# Altium schematic sheet 1_CC1310RF.SchDoc
size 297 x 209 mm
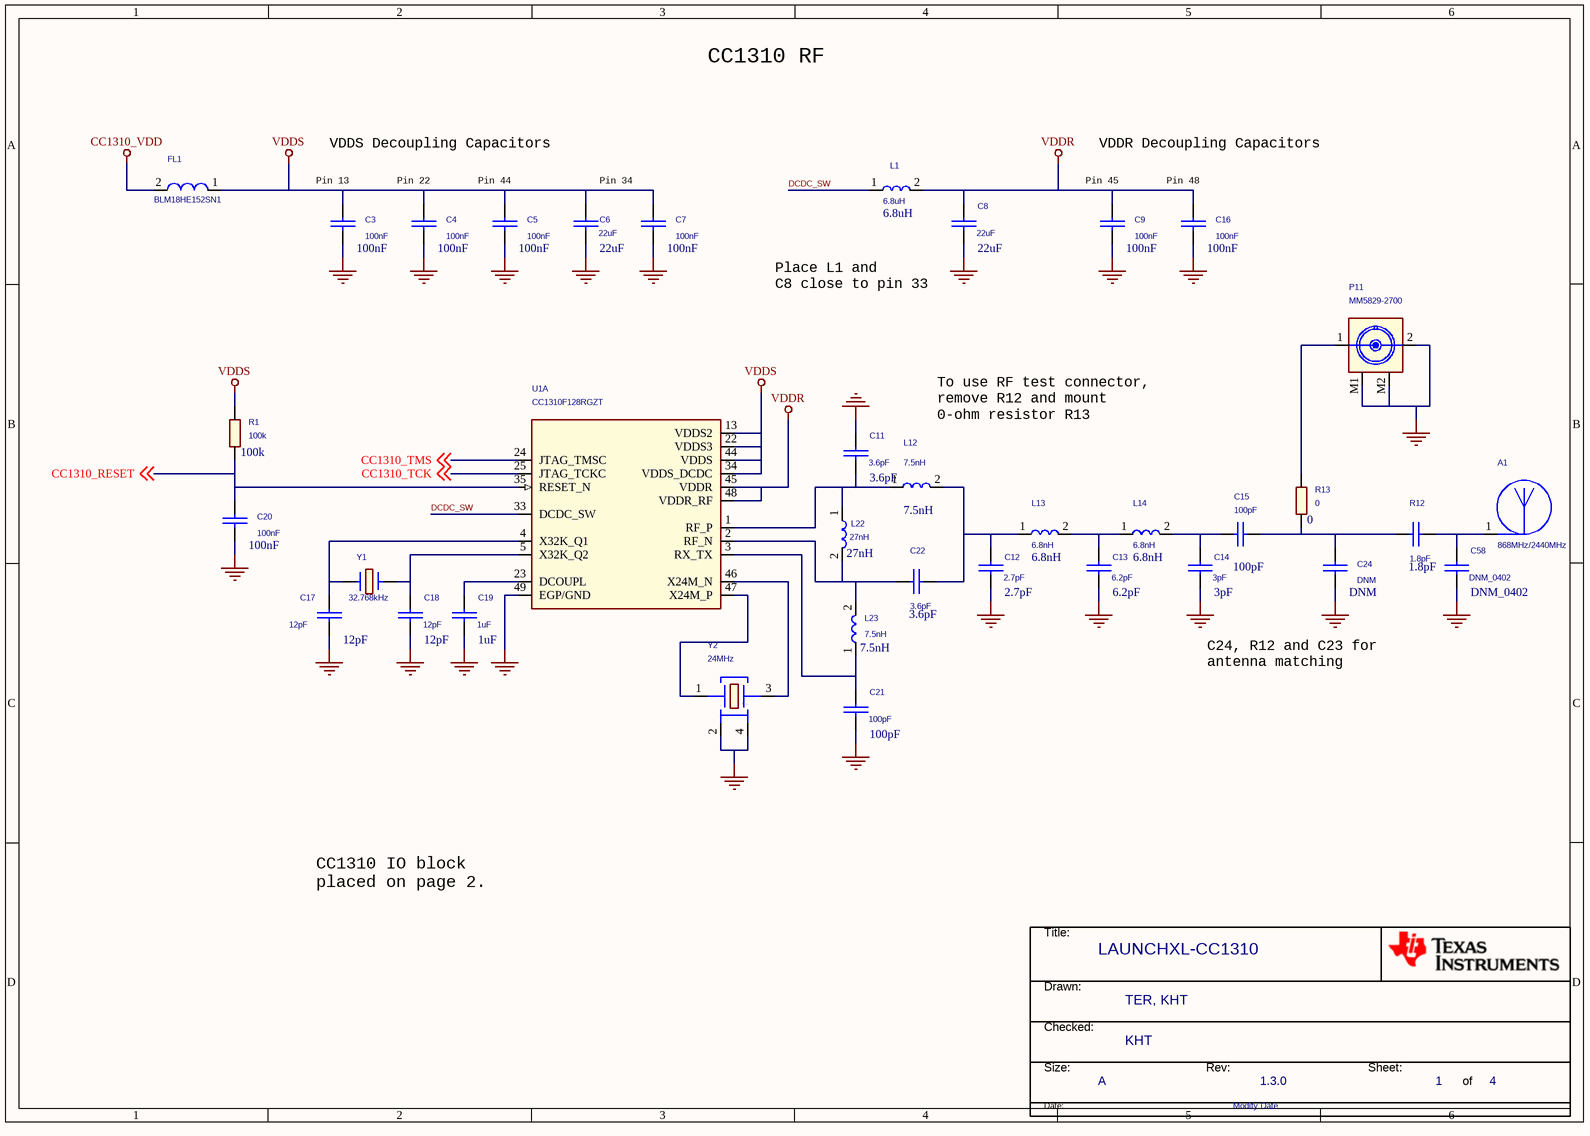
[diagram p0: 1_CC1310RF.SchDoc]

## Parts
*  Designer name: KHT  Check name: TER, KHT  Design Modify Date: Modify Date  Page Size: A  RevCode: 1.3.0  Page Count: 4  Page Number: 1  Title: LAUNCHXL-CC1310  (hidden comment: TI_Norway_Title_Block_BMP)  (graphical)
A1  868MHz/2440MHz  [ANTENNA_DN024N]
C3  100nF  [CAPC1005X60B2N]
C4  100nF  [CAPC1005X60B2N]
C5  100nF  [CAPC1005X60B2N]
C6  22uF  [CAPC1608X100A2N]
C7  100nF  [CAPC1005X60B2N]
C8  22uF  [CAPC1608X100A2L]
C9  100nF  [CAPC1005X60B2N]
C11  3.6pF  [CAPC1005X60B2N]
C12  2.7pF  [CAPC1005X60B2N]
C13  6.2pF  [CAPC1005X60B2N]
C14  3pF  [CAPC1005X60B2N]
C15  100pF  [CAPC1005X60B2N]
C16  100nF  [CAPC1005X60B2N]
C17  12pF  [CAPC1005X60B2N]
C18  12pF  [CAPC1005X60B2N]
C19  1uF  [CAPC1005X60B2N]
C20  100nF  [CAPC1005X60B2N]
C21  100pF  [CAPC1005X60B2N]
C22  3.6pF  [CAPC1005X60B2N]
C24  DNM  [CAPC1005X60B2N]
C58  DNM_0402  [CAPC1005X60B2N]
FL1  BLM18HE152SN1  [FIL_BLM18HE152SN1DL]
L1  6.8uH  [INDC2012X150L]
L12  7.5nH  [INDC1005X60B2N]
L13  6.8nH  [INDC1005X60B2N]
L14  6.8nH  [INDC1005X60B2N]
L22  27nH  [INDC1005X60B2N]
L23  7.5nH  [INDC1005X60B2N]
P11  MM5829-2700  [MURATA_MM58292700RJ4_A2N]
R1  100k  [RESC1005X40B2N]
R12  1.8pF  [CAPC1005X60B2N]
R13  0  [RESC1005X40B2N]
U1  CC1310F128RGZT  [QFNFC50P700X700X100-49A2N]  (part A of 2)
Y1  32.768kHz  [XTAL_FC-135N]
Y2  24MHz  [OSCCC250X320X60-4L]

## Nets
CC1310_VDD: FL1.2
GND: C3.2 C4.2 C5.2 C6.2 C7.2 C8.2 C9.2 C11.1 C12.2 C13.2 C14.2 C16.2 C17.2 C18.2 C19.2 C20.2 C21.2 C24.2 C58.2 P11.2 P11.M1 P11.M2 U1.49(EGP/GND) Y2.2 Y2.4
VDDR: C8.1 C9.1 C16.1 L1.2 U1.45(VDDR) U1.48(VDDR_RF)
VDDS: C3.1 C4.1 C5.1 C6.1 C7.1 FL1.1 R1.2 U1.13(VDDS2) U1.22(VDDS3) U1.34(VDDS_DCDC) U1.44(VDDS)
CC1310_RESET: C20.1 R1.1 U1.35(RESET_N) ; off-sheet CC1310_RESET
CC1310_TCK: U1.25(JTAG_TCKC) ; off-sheet CC1310_TCK
CC1310_TMS: U1.24(JTAG_TMSC) ; off-sheet CC1310_TMS
DCDC_SW: L1.1 U1.33(DCDC_SW)
NetA1_1: A1.1 C58.1 R12.2
NetC11_2: C11.2 L12.1 L22.1 U1.1(RF_P)
NetC12_1: C12.1 C22.2 L12.2 L13.1
NetC13_1: C13.1 L13.2 L14.1
NetC14_1: C14.1 C15.1 L14.2
NetC15_2: C15.2 C24.1 R12.1 R13.1
NetC17_1: C17.1 U1.4(X32K_Q1) Y1.1
NetC18_1: C18.1 U1.5(X32K_Q2) Y1.2
NetC19_1: C19.1 U1.23(DCOUPL)
NetC21_1: C21.1 L23.1 U1.3(RX_TX)
NetC22_1: C22.1 L22.2 L23.2 U1.2(RF_N)
NetP11_1: P11.1 R13.2
NetU1_46: U1.46(X24M_N) Y2.3
NetU1_47: U1.47(X24M_P) Y2.1

## Notes on the sheet
- CC1310 RF
- (near C3) Pin 13
- VDDS Decoupling Capacitors
- (near C4) Pin 22
- (near C5) Pin 44
- Pin 34
- (near C9) Pin 45
- VDDR Decoupling Capacitors
- (near C16) Pin 48
- (near C8) Place L1 and
  C8 close to pin 33
- To use RF test connector,
  remove R12 and mount
  0-ohm resistor R13
- C24, R12 and C23 for
  antenna matching
- CC1310 IO block
  placed on page 2.
- (in symbol TI_Norway_Title_Block_BMP) Title:; Drawn:; Checked:; Size:; Rev:; Sheet:; of; Date:

## Library data of the parts
* = TI_Norway_Title_Block_BMP: OrgName: Texas Instruments
A1 = ANTENNA_PCB: ANTENNA, NON COMPONENT, DUAL BAND OPTION - 868MHz/2440MHz, NOT APPLY; Vendor Part Status: ACTIVE; Vendor Part Number: DN024; Part Number: 13-01029; Designed by: Artur Bielinski; CLASS: DISCRETE; Client Status: UNDER_REVIEW; Vendor: TEXAS INSTRUMENTS; Mounting Type: NOT APPLY; BU Name: DYNAMIC PRECISION GDANSK; Design date: 2014-08-21; AutoDoc File: https://notefied-dynamic-precision.com/DB/Apps/Desktop/Item/Object.aspx?id=96668; Datasheet URL 2: N/A; Datasheet URL 1: http://www.ti.com/lit/swra227; Country of Origin: MISSING INFO; Weight: N/A; Packing Type: N/A; Packing Size: N/A; Last Time Buy: N/A; Budget Currency: N/A; Budget Price: N/A; Lead Time: N/A; RoHS Status: MISSING_INFO; Frequency: 868MHz/2440MHz; Min Oper Temp: N/A; Max Oper Temp: N/A; Part Type: MECHANIC\ANTENNA\NON_COMPONENT; Revision: R001
C3 C4 C7 C20 = CAPACITOR: CAPACITOR, CERAMIC X7R, 100nF, 6.3V, -10%/+10%, -55DEGC/+125DEGC, 0402, SMD; Vendor Part Status: NRND; Vendor Part Number: GRM155R70J104KA01D; MPN Status: ACTIVE; Part Number: 02-07610; VOLTAGE: CMAX; CURRENT: CIMAX; KNEE: CBMAX; PSpiceTemplate: C^@REFDES %1 %2 ?TOLERANCE|C^@REFDES| @VALUE ?IC/IC=@IC/ TC=@TC1,@TC2 ?TOLERANCE|\n.model C^@REFDES CAP C=1 DEV=@TOLERANCE%|; DIST: FLAT; SLOPE: CSMAX; MAX_TEMP: CTMAX; TC1: 0; Vendor: MURATA; BU Name: TEXAS INSTRUMENTS NORWAY; Packing Type: TAPE_&_REEL; Packing Size: 10000; Budget Currency: EUR; Budget Price: 0.007; Lead Time: 14; NOTE Status: PREFERRED; Min Tol: -10%; Max Tol: +10%; PCB Package: 0402; Old Footprint: CAPC1005X60N,0402; TC2: 0; Value: 100nF; Country of Origin: PHILIPPINES; Last Time Buy: N/A; AutoDoc File: https://notefied-dynamic-precision.com/DB/Apps/Desktop/Item/Object.aspx?id=113338; Datasheet URL 2: http://search.murata.co.jp/Ceramy/image/img/w_hinm/L0005E.pdf; Datasheet URL 1: http://psearch.murata.com/capacitor/product/GRM155R70J104KA01%23.pdf; WEIGHT: 0.0016g; LifeCycle Status: ACTIVE; RoHS Status: ROHS_COMPLIANT; MPN: GRM155R70J104KA01D; Manufacturer: MURATA; Dielectric Type: X7R; Capacitance: 100nF; Rtd Voltage: 6.3V; Min Oper Temp: -55DEGC; Max Oper Temp: +125DEGC; Part Type: CAPACITOR\CERAMIC\0402\STANDARD; Mounting Type: SMD; Revision: R000
C5 C9 C16 = CAPACITOR: CAPACITOR, CERAMIC X7R, 100nF, 6.3V, -10%/+10%, -55DEGC/+125DEGC, 0402, SMD; Vendor Part Status: NRND; Vendor Part Number: GRM155R70J104KA01D; Part Number: 02-07610; MPN Status: ACTIVE; VOLTAGE: CMAX; CURRENT: CIMAX; KNEE: CBMAX; PSpiceTemplate: C^@REFDES %1 %2 ?TOLERANCE|C^@REFDES| @VALUE ?IC/IC=@IC/ TC=@TC1,@TC2 ?TOLERANCE|\n.model C^@REFDES CAP C=1 DEV=@TOLERANCE%|; DIST: FLAT; SLOPE: CSMAX; MAX_TEMP: CTMAX; TC1: 0; Vendor: MURATA; BU Name: TEXAS INSTRUMENTS NORWAY; Old Footprint: CAPC1005X60N,0402; PCB Package: 0402; Max Tol: +10%; Min Tol: -10%; NOTE Status: PREFERRED; Lead Time: 14; Budget Price: 0.007; Budget Currency: EUR; Packing Size: 10000; Packing Type: TAPE_&_REEL; TC2: 0; Value: 100nF; Country of Origin: PHILIPPINES; Last Time Buy: N/A; Revision: R000; Mounting Type: SMD; Part Type: CAPACITOR\CERAMIC\0402\STANDARD; Max Oper Temp: +125DEGC; Min Oper Temp: -55DEGC; Rtd Voltage: 6.3V; Capacitance: 100nF; Dielectric Type: X7R; Manufacturer: MURATA; MPN: GRM155R70J104KA01D; RoHS Status: ROHS_COMPLIANT; LifeCycle Status: ACTIVE; WEIGHT: 0.0016g; Datasheet URL 1: http://psearch.murata.com/capacitor/product/GRM155R70J104KA01%23.pdf; Datasheet URL 2: http://search.murata.co.jp/Ceramy/image/img/w_hinm/L0005E.pdf; AutoDoc File: https://notefied-dynamic-precision.com/DB/Apps/Desktop/Item/Object.aspx?id=113338
C6 = CAPACITOR: CAPACITOR, CERAMIC, X5R, 22uF, 6.3V, -20%/+20%, -55DEGC/+85DEGC, 0603, SMD; Vendor Part Status: ACTIVE; Vendor Part Number: GRM188R60J226MEA0D; Part Number: 02-07053; VOLTAGE: CMAX; CURRENT: CIMAX; KNEE: CBMAX; PSpiceTemplate: C^@REFDES %1 %2 ?TOLERANCE|C^@REFDES| @VALUE ?IC/IC=@IC/ TC=@TC1,@TC2 ?TOLERANCE|\n.model C^@REFDES CAP C=1 DEV=@TOLERANCE%|; DIST: FLAT; SLOPE: CSMAX; MAX_TEMP: CTMAX; TC1: 0; Client Status: UNDER_REVIEW; ALT_SYMBOLS: CAPC1608X100A2L,CAPC1608X100A2M; Vendor: MURATA; BU Name: DYNAMIC PRECISION GDANSK; PCB Package: 0603; Max Tol: +20%; Min Tol: -20%; NOTE Status: PREFERRED; Lead Time: 26; Budget Price: 0.062; Budget Currency: EUR; Definied Quality: INDUSTRIAL; Packing Size: 4000; Packing Type: TAPE_&_REEL; TC2: 0; Value: 22uF; Country of Origin: JAPAN; Revision: R001; Old Footprint: CAPC1608X100A2N; Mounting Type: SMD; Part Type: CAPACITOR\CERAMIC\0603\STANDARD; Max Oper Temp: +85DEGC; Min Oper Temp: -55DEGC; Rtd Voltage: 6.3V; Capacitance: 22uF; Dielectric Type: X5R; Manufacturer: MURATA; MPN: GRM188R60J226MEA0D; MPN Status: ACTIVE; RoHS Status: ROHS_COMPLIANT; Last Time Buy: N/A; WEIGHT: 0.0091g; Esd Level: N/A; MTBF: N/A; MTBF Standard: N/A; MSL: N/A; Datasheet URL 1: http://psearch.murata.com/capacitor/product/GRM188R60J226MEA0%23.pdf; Datasheet URL 2: N/A; AutoDoc File: https://notefied-dynamic-precision.com/DB/Apps/Desktop/Item/Object.aspx?id=104385; LifeCycle Status: ACTIVE
C8 = CAPACITOR: CAPACITOR, CERAMIC, X5R, 22uF, 6.3V, -20%/+20%, -55DEGC/+85DEGC, 0603, SMD; Part Number: 02-07053; Manufacturer: MURATA; MPN: GRM188R60J226MEA0D; MPN Status: ACTIVE; VOLTAGE: CMAX; CURRENT: CIMAX; KNEE: CBMAX; PSpiceTemplate: C^@REFDES %1 %2 ?TOLERANCE|C^@REFDES| @VALUE ?IC/IC=@IC/ TC=@TC1,@TC2 ?TOLERANCE|\n.model C^@REFDES CAP C=1 DEV=@TOLERANCE%|; DIST: FLAT; SLOPE: CSMAX; MAX_TEMP: CTMAX; TC1: 0; FPLIST: CAPC1608X100A2N,CAPC1608X100A2L,CAPC1608X100A2M; ALT_SYMBOLS: CAPC1608X100A2L,CAPC1608X100A2M; Old Footprint: CAPC1608X100A2N; PCB Package: 0603; Max Tol: +20%; Min Tol: -20%; NOTE Status: PREFERRED; Lead Time: 26; Budget Price: 0.062; Budget Currency: EUR; Definied Quality: INDUSTRIAL; Packing Size: 4000; Packing Type: TAPE_&_REEL; TC2: 0; Value: 22uF; Revision: R001; Mounting Type: SMD; Part Type: CAPACITOR\CERAMIC\0603; Max Oper Temp: +85DEGC; Min Oper Temp: -55DEGC; Rtd Voltage: 6.3V; Capacitance: 22uF; Dielectric Type: X5R; RoHS Status: ROHS_COMPLIANT; LifeCycle Status: ACTIVE; Last Time Buy: N/A; WEIGHT: 0.0091g; Esd Level: N/A; MTBF: N/A; MTBF Standard: N/A; MSL: N/A; Datasheet URL 1: N/A; Datasheet URL 2: http://psearch.murata.com/capacitor/product/GRM188R60J226MEA0%23.pdf; AutoDoc File: http://notefied-dynamic-precision.com/DB/Apps/Desktop/Item/Object.aspx?id=104385
C11 = CAPACITOR: CAPACITOR, CERAMIC C0G/NP0, 3.6pF, 50V, -0.25pF/+0.25pF, -55DEGC/+125DEGC, 0402, SMD; Vendor Part Status: ACTIVE; Vendor Part Number: GRM1555C1H3R6CA01D; Part Number: 02-07631; VOLTAGE: CMAX; CURRENT: CIMAX; KNEE: CBMAX; PSpiceTemplate: C^@REFDES %1 %2 ?TOLERANCE|C^@REFDES| @VALUE ?IC/IC=@IC/ TC=@TC1,@TC2 ?TOLERANCE|\n.model C^@REFDES CAP C=1 DEV=@TOLERANCE%|; DIST: FLAT; SLOPE: CSMAX; MAX_TEMP: CTMAX; TC1: 0; Vendor: MURATA; BU Name: TEXAS INSTRUMENTS NORWAY; Packing Type: TAPE_&_REEL; Packing Size: 10000; Definied Quality: INDUSTRIAL; Budget Currency: EUR; Budget Price: 0.006; Lead Time: 12; NOTE Status: PREFERRED; PCB Package: 0402; Old Footprint: CAPC1005X60N; TC2: 0; Value: 3.6pF; Country of Origin: MISSING INFO; AutoDoc File: https://notefied-dynamic-precision.com/DB/Apps/Desktop/Item/Object.aspx?id=113359; Datasheet URL 2: N/A; Datasheet URL 1: http://psearch.murata.com/capacitor/product/GRM1555C1H3R6CA01%23.pdf; MSL: N/A; MTBF Standard: N/A; MTBF: N/A; Esd Level: N/A; WEIGHT: 0.0016g; Last Time Buy: N/A; LifeCycle Status: ACTIVE; RoHS Status: ROHS_COMPLIANT; MPN Status: ACTIVE; MPN: GRM1555C1H3R6CA01D; Manufacturer: MURATA; Dielectric Type: C0G/NP0; Capacitance: 3.6pF; Rtd Voltage: 50V; Min Tol: -0.25pF; Max Tol: +0.25pF; Min Oper Temp: -55DEGC; Max Oper Temp: +125DEGC; Part Type: CAPACITOR\CERAMIC\0402\STANDARD; Mounting Type: SMD; Revision: R000
C12 = CAPACITOR: CAPACITOR, CERAMIC C0G/NP0, 2.7pF, 50V, -0.25pF/+0.25pF, -55DEGC/+125DEGC, 0402, SMD; MPN Status: ACTIVE; MPN: GRM1555C1H2R7CA01D; Manufacturer: MURATA; Part Number: 02-07628; VOLTAGE: CMAX; CURRENT: CIMAX; KNEE: CBMAX; PSpiceTemplate: C^@REFDES %1 %2 ?TOLERANCE|C^@REFDES| @VALUE ?IC/IC=@IC/ TC=@TC1,@TC2 ?TOLERANCE|\n.model C^@REFDES CAP C=1 DEV=@TOLERANCE%|; DIST: FLAT; SLOPE: CSMAX; MAX_TEMP: CTMAX; TC1: 0; Packing Type: TAPE_&_REEL; Packing Size: 10000; Definied Quality: INDUSTRIAL; Budget Currency: EUR; Budget Price: 0.007; Lead Time: 12; NOTE Status: PREFERRED; PCB Package: 0402; Old Footprint: CAPC1005X60N; BU Name: TEXAS INSTRUMENTS NORWAY; TC2: 0; Value: 2.7pF; AutoDoc File: https://notefied-dynamic-precision.com/DB/Apps/Desktop/Item/Object.aspx?id=113356; Datasheet URL 2: http://search.murata.co.jp/Ceramy/image/img/w_hinm/L0005E.pdf; Datasheet URL 1: http://psearch.murata.com/capacitor/product/GRM1555C1H2R7CA01%23.pdf; MSL: 1; MTBF Standard: N/A; MTBF: N/A; Esd Level: N/A; WEIGHT: 0.0016g; Last Time Buy: N/A; LifeCycle Status: ACTIVE; RoHS Status: ROHS_COMPLIANT; Dielectric Type: C0G/NP0; Capacitance: 2.7pF; Rtd Voltage: 50V; Min Tol: -0.25pF; Max Tol: +0.25pF; Min Oper Temp: -55DEGC; Max Oper Temp: +125DEGC; Part Type: CAPACITOR\CERAMIC\0402\STANDARD; Mounting Type: SMD; Revision: R000; Vendor: MURATA; Vendor Part Number: GRM1555C1H2R7CA01D; Vendor Part Status: ACTIVE; Country of Origin: PHILIPPINES
C13 = CAPACITOR: CAPACITOR, CERAMIC C0G/NP0, 6.2pF, 50V, -0.25pF/+0.25pF, -55DEGC/+125DEGC, 0402, SMD; MPN Status: ACTIVE; MPN: GRM1555C1H6R2CA01D; Manufacturer: MURATA; Part Number: 02-07626; VOLTAGE: CMAX; CURRENT: CIMAX; KNEE: CBMAX; PSpiceTemplate: C^@REFDES %1 %2 ?TOLERANCE|C^@REFDES| @VALUE ?IC/IC=@IC/ TC=@TC1,@TC2 ?TOLERANCE|\n.model C^@REFDES CAP C=1 DEV=@TOLERANCE%|; DIST: FLAT; SLOPE: CSMAX; MAX_TEMP: CTMAX; TC1: 0; Packing Type: TAPE_&_REEL; Packing Size: 10000; Definied Quality: INDUSTRIAL; Budget Currency: EUR; Budget Price: 0.007; Lead Time: 14; NOTE Status: PREFERRED; PCB Package: 0402; Old Footprint: CAPC1005X60N; BU Name: TEXAS INSTRUMENTS NORWAY; TC2: 0; Value: 6.2pF; AutoDoc File: https://notefied-dynamic-precision.com/DB/Apps/Desktop/Item/Object.aspx?id=113354; Datasheet URL 2: http://search.murata.co.jp/Ceramy/image/img/w_hinm/L0005E.pdf; Datasheet URL 1: http://psearch.murata.com/capacitor/product/GRM1555C1H6R2CA01%23.pdf; MSL: 1; MTBF Standard: N/A; MTBF: N/A; Esd Level: N/A; WEIGHT: 0.0016g; Last Time Buy: N/A; LifeCycle Status: ACTIVE; RoHS Status: ROHS_COMPLIANT; Dielectric Type: C0G/NP0; Capacitance: 6.2pF; Rtd Voltage: 50V; Min Tol: -0.25pF; Max Tol: +0.25pF; Min Oper Temp: -55DEGC; Max Oper Temp: +125DEGC; Part Type: CAPACITOR\CERAMIC\0402\STANDARD; Mounting Type: SMD; Revision: R000; Vendor: MURATA; Vendor Part Number: GRM1555C1H6R2CA01D; Vendor Part Status: ACTIVE; Country of Origin: PHILIPPINES
C14 = CAPACITOR: CAPACITOR, CERAMIC C0G/NP0, 3pF, 50V, -0.25pF/+0.25pF, -55DEGC/+125DEGC, 0402, SMD; MPN Status: ACTIVE; MPN: GRM1555C1H3R0CA01D; Manufacturer: MURATA; Part Number: 02-07625; VOLTAGE: CMAX; CURRENT: CIMAX; KNEE: CBMAX; PSpiceTemplate: C^@REFDES %1 %2 ?TOLERANCE|C^@REFDES| @VALUE ?IC/IC=@IC/ TC=@TC1,@TC2 ?TOLERANCE|\n.model C^@REFDES CAP C=1 DEV=@TOLERANCE%|; DIST: FLAT; SLOPE: CSMAX; MAX_TEMP: CTMAX; TC1: 0; Packing Type: TAPE_&_REEL; Packing Size: 10000; Definied Quality: INDUSTRIAL; Budget Currency: EUR; Budget Price: 0.006; Lead Time: 16; NOTE Status: PREFERRED; PCB Package: 0402; Old Footprint: CAPC1005X60N; BU Name: TEXAS INSTRUMENTS NORWAY; TC2: 0; Value: 3pF; AutoDoc File: https://notefied-dynamic-precision.com/DB/Apps/Desktop/Item/Object.aspx?id=113353; Datasheet URL 2: http://search.murata.co.jp/Ceramy/image/img/w_hinm/L0005E.pdf; Datasheet URL 1: http://psearch.murata.com/capacitor/product/GRM1555C1H3R0CA01%23.pdf; MSL: 1; MTBF Standard: N/A; MTBF: N/A; Esd Level: N/A; WEIGHT: 0.0016g; Last Time Buy: N/A; LifeCycle Status: ACTIVE; RoHS Status: ROHS_COMPLIANT; Dielectric Type: C0G/NP0; Capacitance: 3pF; Rtd Voltage: 50V; Min Tol: -0.25pF; Max Tol: +0.25pF; Min Oper Temp: -55DEGC; Max Oper Temp: +125DEGC; Part Type: CAPACITOR\CERAMIC\0402\STANDARD; Mounting Type: SMD; Revision: R000; Vendor: MURATA; Vendor Part Number: GRM1555C1H3R0CA01D; Vendor Part Status: ACTIVE; Country of Origin: PHILIPPINES
C15 C21 = CAPACITOR: CAPACITOR, CERAMIC C0G/NP0, 100pF, 50V, -5%/+5%, -55DEGC/+125DEGC, 0402, SMD; Vendor Part Status: ACTIVE; Vendor Part Number: GRM1555C1H101JA01D; Part Number: 02-07619; VOLTAGE: CMAX; CURRENT: CIMAX; KNEE: CBMAX; PSpiceTemplate: C^@REFDES %1 %2 ?TOLERANCE|C^@REFDES| @VALUE ?IC/IC=@IC/ TC=@TC1,@TC2 ?TOLERANCE|\n.model C^@REFDES CAP C=1 DEV=@TOLERANCE%|; DIST: FLAT; SLOPE: CSMAX; MAX_TEMP: CTMAX; TC1: 0; Vendor: MURATA; BU Name: TEXAS INSTRUMENTS NORWAY; Packing Type: TAPE_&_REEL; Packing Size: 10000; Definied Quality: INDUSTRIAL; Budget Currency: EUR; Budget Price: 0.004; Lead Time: 12; NOTE Status: PREFERRED; Min Tol: -5%; Max Tol: +5%; PCB Package: 0402; Old Footprint: CAPC1005X60N; TC2: 0; Value: 100pF; Country of Origin: CHINA,PHILIPPINES; AutoDoc File: https://notefied-dynamic-precision.com/DB/Apps/Desktop/Item/Object.aspx?id=113347; Datasheet URL 2: http://search.murata.co.jp/Ceramy/image/img/w_hinm/L0005E.pdf; Datasheet URL 1: http://psearch.murata.com/capacitor/product/GRM1555C1H101JA01%23.pdf; MSL: 1; MTBF Standard: N/A; MTBF: N/A; Esd Level: N/A; WEIGHT: 0.0016g; Last Time Buy: N/A; LifeCycle Status: ACTIVE; RoHS Status: ROHS_COMPLIANT; MPN Status: ACTIVE; MPN: GRM1555C1H101JA01D; Manufacturer: MURATA; Dielectric Type: C0G/NP0; Capacitance: 100pF; Rtd Voltage: 50V; Min Oper Temp: -55DEGC; Max Oper Temp: +125DEGC; Part Type: CAPACITOR\CERAMIC\0402\STANDARD; Mounting Type: SMD; Revision: R000
C17 C18 = CAPACITOR: CAPACITOR, CERAMIC C0G/NP0, 12pF, 50V, -5%/+5%, -55DEGC/+125DEGC, 0402, SMD; Vendor Part Status: ACTIVE; Vendor Part Number: GRM1555C1H120JA01D; Part Number: 02-07617; Manufacturer: MANUFACTURER SELECTION; MPN: CAPACITOR_0402_12pF_C0G/NP0_M_+/-5%_50V; VOLTAGE: CMAX; CURRENT: CIMAX; KNEE: CBMAX; PSpiceTemplate: C^@REFDES %1 %2 ?TOLERANCE|C^@REFDES| @VALUE ?IC/IC=@IC/ TC=@TC1,@TC2 ?TOLERANCE|\n.model C^@REFDES CAP C=1 DEV=@TOLERANCE%|; DIST: FLAT; SLOPE: CSMAX; MAX_TEMP: CTMAX; TC1: 0; Vendor: MURATA; BU Name: TEXAS INSTRUMENTS NORWAY; Old Footprint: CAPC1005X60N; PCB Package: 0402; Max Tol: +5%; Min Tol: -5%; NOTE Status: PREFERRED; Lead Time: 12; Budget Price: 0.007; Budget Currency: EUR; Definied Quality: INDUSTRIAL; Packing Size: 10000; Packing Type: TAPE_&_REEL; TC2: 0; Value: 12pF; Country of Origin: PHILIPPINES; Revision: R000; Mounting Type: SMD; Part Type: CAPACITOR\CERAMIC\0402\STANDARD; Max Oper Temp: +125DEGC; Min Oper Temp: -55DEGC; Rtd Voltage: 50V; Capacitance: 12pF; Dielectric Type: C0G/NP0; MPN Status: ACTIVE; RoHS Status: ROHS_COMPLIANT; LifeCycle Status: ACTIVE; Last Time Buy: N/A; WEIGHT: 0.0016g; Esd Level: N/A; MTBF: N/A; MTBF Standard: N/A; MSL: N/A; Datasheet URL 1: http://psearch.murata.com/capacitor/product/GRM1555C1H120JA01%23.pdf; Datasheet URL 2: http://search.murata.co.jp/Ceramy/image/img/w_hinm/L0005E.pdf; AutoDoc File: https://notefied-dynamic-precision.com/DB/Apps/Desktop/Item/Object.aspx?id=113345
C19 = CAPACITOR: CAPACITOR, CERAMIC X5R, 1uF, 10V, -10%/+10%, -55DEGC/+85DEGC, 0402, SMD; Vendor Part Status: NRND; Vendor Part Number: GRM155R61A105KE15D; MPN Status: ACTIVE; Part Number: 02-07611; VOLTAGE: CMAX; CURRENT: CIMAX; KNEE: CBMAX; PSpiceTemplate: C^@REFDES %1 %2 ?TOLERANCE|C^@REFDES| @VALUE ?IC/IC=@IC/ TC=@TC1,@TC2 ?TOLERANCE|\n.model C^@REFDES CAP C=1 DEV=@TOLERANCE%|; DIST: FLAT; SLOPE: CSMAX; MAX_TEMP: CTMAX; TC1: 0; Vendor: MURATA; BU Name: TEXAS INSTRUMENTS NORWAY; Packing Type: TAPE_&_REEL; Packing Size: 10000; Definied Quality: INDUSTRIAL; Budget Currency: EUR; Budget Price: 0.019; Lead Time: 12; NOTE Status: PREFERRED; Min Tol: -10%; Max Tol: +10%; PCB Package: 0402; Old Footprint: CAPC1005X60N,0402; TC2: 0; Value: 1uF; Country of Origin: PHILIPPINES,CHINA; AutoDoc File: https://notefied-dynamic-precision.com/DB/Apps/Desktop/Item/Object.aspx?id=113339; Datasheet URL 2: http://search.murata.co.jp/Ceramy/image/img/w_hinm/L0005E.pdf; Datasheet URL 1: http://psearch.murata.com/capacitor/product/GRM155R61A105KE15%23.pdf; MSL: 1; MTBF Standard: N/A; MTBF: N/A; Esd Level: N/A; WEIGHT: 0.0016g; Last Time Buy: N/A; RoHS Status: ROHS_COMPLIANT; MPN: GRM155R61A105KE15D; Manufacturer: MURATA; Dielectric Type: X5R; Capacitance: 1uF; Rtd Voltage: 10V; Min Oper Temp: -55DEGC; Max Oper Temp: +85DEGC; Part Type: CAPACITOR\CERAMIC\0402\STANDARD; Mounting Type: SMD; Revision: R000
C22 = CAPACITOR: CAPACITOR, CERAMIC C0G/NP0, 3.6pF, 50V, -0.25pF/+0.25pF, -55DEGC/+125DEGC, 0402, SMD; Vendor Part Status: ACTIVE; Vendor Part Number: GRM1555C1H3R6CA01D; Part Number: 02-07631; VOLTAGE: CMAX; CURRENT: CIMAX; KNEE: CBMAX; PSpiceTemplate: C^@REFDES %1 %2 ?TOLERANCE|C^@REFDES| @VALUE ?IC/IC=@IC/ TC=@TC1,@TC2 ?TOLERANCE|\n.model C^@REFDES CAP C=1 DEV=@TOLERANCE%|; DIST: FLAT; SLOPE: CSMAX; MAX_TEMP: CTMAX; TC1: 0; Vendor: MURATA; BU Name: TEXAS INSTRUMENTS NORWAY; Old Footprint: CAPC1005X60N; PCB Package: 0402; NOTE Status: PREFERRED; Lead Time: 12; Budget Price: 0.006; Budget Currency: EUR; Definied Quality: INDUSTRIAL; Packing Size: 10000; Packing Type: TAPE_&_REEL; TC2: 0; Value: 3.6pF; Country of Origin: MISSING INFO; Revision: R000; Mounting Type: SMD; Part Type: CAPACITOR\CERAMIC\0402\STANDARD; Max Oper Temp: +125DEGC; Min Oper Temp: -55DEGC; Max Tol: +0.25pF; Min Tol: -0.25pF; Rtd Voltage: 50V; Capacitance: 3.6pF; Dielectric Type: C0G/NP0; Manufacturer: MURATA; MPN: GRM1555C1H3R6CA01D; MPN Status: ACTIVE; RoHS Status: ROHS_COMPLIANT; LifeCycle Status: ACTIVE; Last Time Buy: N/A; WEIGHT: 0.0016g; Esd Level: N/A; MTBF: N/A; MTBF Standard: N/A; MSL: N/A; Datasheet URL 1: http://psearch.murata.com/capacitor/product/GRM1555C1H3R6CA01%23.pdf; Datasheet URL 2: N/A; AutoDoc File: https://notefied-dynamic-precision.com/DB/Apps/Desktop/Item/Object.aspx?id=113359
C24 = CAPACITOR: CAPACITOR, CERAMIC, TBD, -55DEGC/+125DEGC, 0402, DNM, SMD; Part Number: 02-07616; Vendor Part Number: CAPACITOR_0402_DNM_N/A_M; Vendor Part Status: ACTIVE; VOLTAGE: CMAX; CURRENT: CIMAX; KNEE: CBMAX; PSpiceTemplate: C^@REFDES %1 %2 ?TOLERANCE|C^@REFDES| @VALUE ?IC/IC=@IC/ TC=@TC1,@TC2 ?TOLERANCE|\n.model C^@REFDES CAP C=1 DEV=@TOLERANCE%|; DIST: FLAT; SLOPE: CSMAX; MAX_TEMP: CTMAX; TC1: 0; BU Name: TEXAS INSTRUMENTS NORWAY; PCB Package: 0402; Dielectric Type: MISSING-INFO; Vendor: MANUFACTURER SELECTION; Budget Price: 0.00589; Budget Currency: USD; Packing Size: 10000; Packing Type: TAPE_&_REEL; TC2: 0; Value: DNM; Revision: R000; Mounting Type: SMD; Part Type: CAPACITOR\CERAMIC\0402\STANDARD; Max Oper Temp: +125DEGC; Min Oper Temp: -55DEGC; RoHS Status: MISSING_INFO; Lead Time: N/A; Last Time Buy: N/A; Weight: N/A; Country of Origin: MISSING INFO; Datasheet URL 1: N/A; Datasheet URL 2: N/A; AutoDoc File: https://notefied-dynamic-precision.com/DB/Apps/Desktop/Item/Object.aspx?id=113344
C58 = CAPACITOR: CAPACITOR, CERAMIC, TBD, -55DEGC/+125DEGC, 0402, DNM, SMD; Vendor Part Status: ACTIVE; Vendor Part Number: CAPACITOR_0402_DNM_N/A_M; Part Number: 02-07616; Manufacturer: MURATA; MPN: GRM1555C1H3R4CA01D; VOLTAGE: CMAX; CURRENT: CIMAX; KNEE: CBMAX; PSpiceTemplate: C^@REFDES %1 %2 ?TOLERANCE|C^@REFDES| @VALUE ?IC/IC=@IC/ TC=@TC1,@TC2 ?TOLERANCE|\n.model C^@REFDES CAP C=1 DEV=@TOLERANCE%|; DIST: FLAT; SLOPE: CSMAX; MAX_TEMP: CTMAX; TC1: 0; Vendor: MANUFACTURER SELECTION; BU Name: TEXAS INSTRUMENTS NORWAY; Old Footprint: CAPC1005X60A2N; PCB Package: 0402; Dielectric Type: MISSING-INFO; NOTE Status: PREFERRED; Budget Price: 0.00589; Budget Currency: USD; Definied Quality: INDUSTRIAL; Packing Size: 10000; Packing Type: TAPE_&_REEL; TC2: 0; Value: DNM_0402; Revision: R000; Mounting Type: SMD; Part Type: CAPACITOR\CERAMIC\0402\STANDARD; Max Oper Temp: +125DEGC; Min Oper Temp: -55DEGC; MPN Status: ACTIVE; RoHS Status: MISSING_INFO; Lead Time: N/A; Datasheet URL 1: N/A; Datasheet URL 2: N/A; AutoDoc File: https://notefied-dynamic-precision.com/DB/Apps/Desktop/Item/Object.aspx?id=113344; Last Time Buy: N/A; Weight: N/A; Country of Origin: MISSING INFO
FL1 = FILTER_2PIN: FILTER, EMI, 1500@100MHz, -55DEGC/+125DEGC, 0603, SMD; MPN Status: ACTIVE; MPN: BLM18HE152SN1D; Manufacturer: MURATA; Part Number: 04-00470; Packing Type: TAPE_&_REEL; Packing Size: 4000; Budget Currency: EUR; Budget Price: 0.085; Lead Time: 26; NOTE Status: PREFERRED; Rtd Current: 0.5A; Min Tol: -25%; Max Tol: +25%; PCB Package: 0603; Old Footprint: FIL_BLM18HE152SN1DN; ALT_SYMBOLS: FIL_BLM18HE152SN1DL,FIL_BLM18HE152SN1DM; FPLIST: FIL_BLM18HE152SN1DN,FIL_BLM18HE152SN1DL,FIL_BLM18HE152SN1DM; AutoDoc File: http://notefied-dynamic-precision.com/DB/Apps/Desktop/Item/Object.aspx?id=85575; Datasheet URL 2: http://search.murata.co.jp/Ceramy/image/img/PDF/ENG/L0110S0101BLM18H.pdf; Datasheet URL 1: http://search.murata.co.jp/Ceramy/image/img/PDF/ENG/L0110S0101BLM18H.pdf; WEIGHT: 0.006g; RoHS Status: ROHS_COMPLIANT; Impedance: 1500@100MHz; Min Oper Temp: -55DEGC; Max Oper Temp: +125DEGC; Part Type: FILTER\EMI\0603; Mounting Type: SMD; Revision: R001
L1 = INDUCTOR: INDUCTOR, STANDARD, CHIP, FERRITE CORE, SHIELDED, 6.8uH, -20%/+20%, 1.1A, -55DEGC/+125DEGC, 0805, SMD; Part Number: 03-07266; Manufacturer: TDK; MPN: MLZ2012N6R8LT000; MPN Status: ACTIVE; DIST: FLAT; DIELECTRIC: DSMAX; PSpiceTemplate: L^@REFDES %1 %2 ?TOLERANCE|L^@REFDES| @VALUE ?IC/IC=@IC/ ?TOLERANCE|\n.model l^@REFDES IND L=1 DEV=@TOLERANCE%|; Current: LMAX; FPLIST: INDC2012X150N,INDC2012X150L,INDC2012X150M; ALT_SYMBOLS: INDC2012X150L,INDC2012X150M; Old Footprint: INDC2012X150N; PCB Package: 0805; Max Tol: +20%; Min Tol: -20%; Resistance: 0.25; NOTE Status: PREFERRED; Packing Size: 4000; Packing Type: TAPE_&_REEL; Value: 6.8uH; Revision: R001; Mounting Type: SMD; Part Type: INDUCTOR\STANDARD\CHIP\0805; Max Oper Temp: +125DEGC; Min Oper Temp: -55DEGC; Rtd Current: 1.1A; Inductance: 6.8uH; RoHS Status: ROHS_COMPLIANT; LifeCycle Status: ACTIVE; Last Time Buy: N/A; WEIGHT: 0.01g; Datasheet URL 1: N/A; Datasheet URL 2: http://product.tdk.com/inductor/ind/detailed_information.php?lang=en&ref=us&part_no=MLZ2012N6R8LT000; AutoDoc File: http://notefied-dynamic-precision.com/DB/Apps/Desktop/Item/Object.aspx?id=102853
L12 L23 = INDUCTOR: INDUCTOR, RF, CHIP, NON-MAGNETIC CORE, 7.5nH, -5%/+5%, 0.3A, -55DEGC/+125DEGC, 0402, SMD; Part Number: 03-07533; Vendor Part Number: LQG15HS7N5J02D; Vendor Part Status: ACTIVE; DIST: FLAT; DIELECTRIC: DSMAX; PSpiceTemplate: L^@REFDES %1 %2 ?TOLERANCE|L^@REFDES| @VALUE ?IC/IC=@IC/ ?TOLERANCE|\n.model l^@REFDES IND L=1 DEV=@TOLERANCE%|; Current: LMAX; BU Name: TEXAS INSTRUMENTS NORWAY; PCB Package: 0402; Max Tol: +5%; Min Tol: -5%; Resistance: 0.24; Frequency: 4.2GHz; Vendor: MURATA; Lead Time: 10; Budget Price: 0.03; Budget Currency: EUR; Packing Size: 10000; Packing Type: TAPE_&_REEL; Value: 7.5nH; Revision: R000; Mounting Type: SMD; Part Type: INDUCTOR\RF\CHIP\0402; Max Oper Temp: +125DEGC; Min Oper Temp: -55DEGC; Rtd Current: 0.3A; Inductance: 7.5nH; Core Material: NON-MAGNETIC; RoHS Status: ROHS_COMPLIANT; Last Time Buy: N/A; Weight: 0.001g; Country of Origin: MISSING INFO; Datasheet URL 1: http://psearch.murata.com/inductor/product/LQG15HS7N5J02%23.pdf; Datasheet URL 2: N/A; AutoDoc File: https://notefied-dynamic-precision.com/DB/Apps/Desktop/Item/Object.aspx?id=113370
L13 L14 = INDUCTOR: INDUCTOR, RF, CHIP, NON-MAGNETIC CORE, 6.8nH, -5%/+5%, 0.3A, -55DEGC/+125DEGC, 0402, SMD; Vendor Part Status: ACTIVE; Vendor Part Number: LQG15HS6N8J02D; Part Number: 03-07532; DIST: FLAT; DIELECTRIC: DSMAX; PSpiceTemplate: L^@REFDES %1 %2 ?TOLERANCE|L^@REFDES| @VALUE ?IC/IC=@IC/ ?TOLERANCE|\n.model l^@REFDES IND L=1 DEV=@TOLERANCE%|; Current: LMAX; Vendor: MURATA; BU Name: TEXAS INSTRUMENTS NORWAY; Old Footprint: INDC1005X60N; PCB Package: 0402; Max Tol: +5%; Min Tol: -5%; Resistance: 0.24; Frequency: 4.5GHz; NOTE Status: PREFERRED; Lead Time: 9; Budget Price: 0.03; Budget Currency: EUR; Definied Quality: INDUSTRIAL; Packing Size: 10000; Packing Type: TAPE_&_REEL; Value: 6.8nH; Country of Origin: JAPAN,SINGAPORE; Core Material: NON-MAGNETIC; Revision: R000; Mounting Type: SMD; Part Type: INDUCTOR\RF\CHIP\0402; Max Oper Temp: +125DEGC; Min Oper Temp: -55DEGC; Rtd Current: 0.3A; Inductance: 6.8nH; Manufacturer: MURATA; MPN: LQG15HS6N8J02D; MPN Status: ACTIVE; RoHS Status: ROHS_COMPLIANT; LifeCycle Status: ACTIVE; Last Time Buy: N/A; WEIGHT: 0.001g; Esd Level: N/A; MTBF: N/A; MTBF Standard: N/A; MSL: N/A; Datasheet URL 1: http://psearch.murata.com/inductor/product/LQG15HS6N8J02%23.pdf; Datasheet URL 2: N/A; AutoDoc File: https://notefied-dynamic-precision.com/DB/Apps/Desktop/Item/Object.aspx?id=113369
L22 = INDUCTOR: INDUCTOR, RF, CHIP, NON-MAGNETIC CORE, 27nH, -5%/+5%, 0.3A, -55DEGC/+125DEGC, 0402, SMD; Vendor Part Status: ACTIVE; Vendor Part Number: LQG15HS27NJ02D; Part Number: 03-07528; DIST: FLAT; DIELECTRIC: DSMAX; PSpiceTemplate: L^@REFDES %1 %2 ?TOLERANCE|L^@REFDES| @VALUE ?IC/IC=@IC/ ?TOLERANCE|\n.model l^@REFDES IND L=1 DEV=@TOLERANCE%|; Current: LMAX; Vendor: MURATA; BU Name: TEXAS INSTRUMENTS NORWAY; Old Footprint: INDC1005X60N; PCB Package: 0402; Max Tol: +5%; Min Tol: -5%; Resistance: 0.46; Frequency: 1700MHz; NOTE Status: PREFERRED; Lead Time: 9; Budget Price: 0.03; Budget Currency: EUR; Definied Quality: INDUSTRIAL; Packing Size: 10000; Packing Type: TAPE_&_REEL; Value: 27nH; Country of Origin: JAPAN,SINGAPORE; Core Material: NON-MAGNETIC; Revision: R000; Mounting Type: SMD; Part Type: INDUCTOR\RF\CHIP\0402; Max Oper Temp: +125DEGC; Min Oper Temp: -55DEGC; Rtd Current: 0.3A; Inductance: 27nH; Manufacturer: MURATA; MPN: LQG15HS27NJ02D; MPN Status: ACTIVE; RoHS Status: ROHS_COMPLIANT; LifeCycle Status: ACTIVE; Last Time Buy: N/A; WEIGHT: 0.001g; Esd Level: N/A; MTBF: N/A; MTBF Standard: N/A; MSL: N/A; Datasheet URL 1: http://psearch.murata.com/inductor/product/LQG15HS27NJ02%23.pdf; Datasheet URL 2: N/A; AutoDoc File: https://notefied-dynamic-precision.com/DB/Apps/Desktop/Item/Object.aspx?id=113365
P11 = CONN_COAX_1_1_P_2MH: CONNECTOR, COAX, MALE, UP TO 12GHz, 30V, SMD; Part Number: 06-05051; Manufacturer: MURATA; MPN: MM5829-2700RJ4; MPN Status: ACTIVE; CLASS: IO; FPLIST: MURATA_MM58292700RJ4_A2N,MURATA_MM58292700RJ4_A2L,MURATA_MM58292700RJ4_A2M; ALT_SYMBOLS: MURATA_MM58292700RJ4_A2L,MURATA_MM58292700RJ4_A2M; Max Oper Temp: +85DEGC; Min Oper Temp: -40DEGC; Rtd Power: 2W; Impedance: 50; NOTE Status: PREFERRED; Packing Size: 4000; Packing Type: TAPE_&_REEL; Revision: R001; Old Footprint: MURATA_MM58292700RJ4_A2N; Mounting Type: SMD; Part Type: CONNECTOR\COAX; Rtd Voltage: 30V; Frequency: 12GHz; RoHS Status: ROHS_COMPLIANT; Datasheet URL 1: http://search.murata.co.jp/Ceramy/image/img/w_hinm/L0390E.pdf; Datasheet URL 2: http://www.murata.com/~/media/webrenewal/support/library/catalog/products/switch/switch/o33e.ashx; AutoDoc File: http://notefied-dynamic-precision.com/DB/Apps/Desktop/Item/Object.aspx?id=105030
R1 = RESISTOR: RESISTOR, THICK FILM, 100k, -5%/+5%, 0.063W, 50V, -55DEGC/+155DEGC, 0402, SMD; Vendor Part Status: ACTIVE; Vendor Part Number: RESISTOR_0402_100k_+/-5%_50V_0.063W_M_+/-200ppm; Part Number: 01-22356; MPN: RESISTOR_0402_100k_+/-1%_50V_0.063W_M_+/-100PPM; PSpiceTemplate: R^@REFDES %1 %2 ?TOLERANCE|R^@REFDES| @VALUE TC=@TC1,@TC2 ?TOLERANCE|\n.model R^@REFDES RES R=1 DEV=@TOLERANCE%|; VOLTAGE: RVMAX; DIST: FLAT; MAX_TEMP: RTMAX; TC1: 0; POWER: RMAX; Vendor: MANUFACTURER SELECTION; BU Name: TEXAS INSTRUMENTS NORWAY; Old Footprint: RESC1005X40N; PCB Package: 0402; Max Tol: +5%; Min Tol: -5%; Max TC: +200PPM/DEGC; Min TC: -200PPM/DEGC; NOTE Status: PREFERRED; Budget Price: 0.00244; Budget Currency: USD; Definied Quality: INDUSTRIAL; Packing Size: 10000; Packing Type: TAPE_&_REEL; TC2: 0; Value: 100k; Country of Origin: MISSING INFO; Rtd Current: N/A; Revision: R000; Mounting Type: SMD; Part Type: RESISTOR\0402\STANDARD; Max Oper Temp: +155DEGC; Min Oper Temp: -55DEGC; Rtd Voltage: 50V; Rtd Power: 0.063W; Resistance: 100k; Resistor Type: THICK FILM; Manufacturer: MANUFACTURER SELECTION; MPN Status: ACTIVE; RoHS Status: ROHS_COMPLIANT; LifeCycle Status: ACTIVE; Lead Time: N/A; Last Time Buy: N/A; WEIGHT: N/A; Esd Level: N/A; MTBF: N/A; MTBF Standard: N/A; MSL: N/A; Datasheet URL 1: N/A; Datasheet URL 2: N/A; AutoDoc File: https://notefied-dynamic-precision.com/DB/Apps/Desktop/Item/Object.aspx?id=113329
R12 = CAPACITOR: CAPACITOR, CERAMIC C0G/NP0, 1.8pF, 50V, -0.1pF/+0.1pF, -55DEGC/+125DEGC, 0402, SMD; Vendor Part Status: ACTIVE; Vendor Part Number: GJM1555C1H1R8BB01D; Part Number: 02-01199; VOLTAGE: CMAX; CURRENT: CIMAX; KNEE: CBMAX; PSpiceTemplate: C^@REFDES %1 %2 ?TOLERANCE|C^@REFDES| @VALUE ?IC/IC=@IC/ TC=@TC1,@TC2 ?TOLERANCE|\n.model C^@REFDES CAP C=1 DEV=@TOLERANCE%|; DIST: FLAT; SLOPE: CSMAX; MAX_TEMP: CTMAX; TC1: 0; Packing Type: TAPE_&_REEL; Packing Size: 10000; Budget Currency: EUR; Budget Price: 0.037; Lead Time: 11; Vendor: MURATA; Min Tol: -0.1pF; Max Tol: +0.1pF; PCB Package: 0402; ALT_SYMBOLS: CAPC1005X60B2L,CAPC1005X60B2M; BU Name: DYNAMIC PRECISION GDANSK; Client Status: UNDER_REVIEW; TC2: 0; Value: 1.8pF; AutoDoc File: https://notefied-dynamic-precision.com/DB/Apps/Desktop/Item/Object.aspx?id=50350; Datasheet URL 2: http://search.murata.co.jp/Ceramy/image/img/w_hinm/L0005E.pdf; Datasheet URL 1: http://psearch.murata.com/capacitor/product/GJM1555C1H1R8BB01%23.pdf; Country of Origin: JAPAN,SINGAPORE; Weight: 0.0016g; Last Time Buy: N/A; RoHS Status: ROHS_COMPLIANT; Dielectric Type: C0G/NP0; Capacitance: 1.8pF; Rtd Voltage: 50V; Min Oper Temp: -55DEGC; Max Oper Temp: +125DEGC; Part Type: CAPACITOR\CERAMIC\0402\STANDARD; Mounting Type: SMD; Revision: R002
R13 = RESISTOR: RESISTOR, THICK FILM, 0, -5%/+5%, 0.063W, 50V, -55DEGC/+155DEGC, 0402, SMD; Vendor Part Status: ACTIVE; Vendor Part Number: RESISTOR_0402_0_+/-5%_50V_0.063W_M_+/-200ppm; Part Number: 01-22341; Manufacturer: DO NOT MOUNT; MPN: DNM; PSpiceTemplate: R^@REFDES %1 %2 ?TOLERANCE|R^@REFDES| @VALUE TC=@TC1,@TC2 ?TOLERANCE|\n.model R^@REFDES RES R=1 DEV=@TOLERANCE%|; VOLTAGE: RVMAX; DIST: FLAT; MAX_TEMP: RTMAX; POWER: RMAX; Packing Type: TAPE_&_REEL; Vendor: MANUFACTURER SELECTION; BU Name: TEXAS INSTRUMENTS NORWAY; Old Footprint: RESC1005X40N,0402; PCB Package: 0402; Max TC: +200PPM/DEGC; Min TC: -200PPM/DEGC; NOTE Status: PREFERRED; Budget Price: 0.00244; Budget Currency: USD; Packing Size: 10000; TC1: 0; TC2: 0; Value: 0; Country of Origin: MISSING INFO; Revision: R000; Mounting Type: SMD; Part Type: RESISTOR\0402\JUMPER; Max Oper Temp: +155DEGC; Min Oper Temp: -55DEGC; Max Tol: N/A; Min Tol: N/A; Rtd Voltage: 50V; Rtd Current: N/A; Rtd Power: 0.063W; Resistance: 0; Resistor Type: THICK FILM; MPN Status: ACTIVE; RoHS Status: ROHS_COMPLIANT; LifeCycle Status: ACTIVE; Lead Time: N/A; Last Time Buy: N/A; WEIGHT: N/A; Esd Level: N/A; MTBF: N/A; MTBF Standard: N/A; MSL: N/A; Datasheet URL 1: N/A; Datasheet URL 2: N/A; AutoDoc File: https://notefied-dynamic-precision.com/DB/Apps/Desktop/Item/Object.aspx?id=113314
U1 = IC_RF_CC1310F128RGZT_VQFN48: IC, MICROCONTROLLER, 128kB, 1.8V TO 3.8V, VQFN48-EP, SMD; Vendor Part Status: ACTIVE; Part Number: 18-32855; SWAP_INFO: (S1+S2); SPLIT_INST: TRUE; Designed_By: Artur Bielinski; Packing Type: TAPE_&_REEL; Packing Size: 250; Budget Currency: EUR; Budget Price: 4.69; Lead Time: 2; Client Status: UNDER_REVIEW; Vendor: TEXAS INSTRUMENTS; Min Oper Temp: -40DEGC; Max Oper Temp: +85DEGC; ALT_SYMBOLS: QFNFC50P700X700X100-49A2L,QFNFC50P700X700X100-49A2M; BU Name: DYNAMIC PRECISION GDANSK; CLASS: IC; Design_Date: 2015-11-27; AutoDoc File: https://notefied-dynamic-precision.com/DB/Apps/Desktop/Item/Object.aspx?id=113282; Datasheet URL 1: http://www.ti.com/lit/ds/symlink/cc1310.pdf; RoHS Status: ROHS_COMPLIANT; Vendor Part Number: CC1310F128RGZT; Rtd Voltage: 1.8V TO 3.8V; Part Type: IC\MICROCONTROLLER\TEXAS_INSTRUMENTS; Mounting Type: SMD; PCB Package: VQFN48-EP; Revision: R001
Y1 = CRYSTAL: CRYSTAL, RESONATOR, 32.768kHz, -20PPM/+20PPM, -40DEGC/+85DEGC, SMD; MPN Status: ACTIVE; MPN: FC-135 32.7680KA-AG0; Manufacturer: EPSON; Part Number: 12-00546; Packing Type: TAPE_&_REEL; Packing Size: 1000; Definied Quality: INDUSTRIAL; Budget Currency: USD; Budget Price: 1.25375; Lead Time: 10; NOTE Status: PREFERRED; Capacitance: 7pF; Min Tol: -20PPM; Max Tol: +20PPM; ALT_SYMBOLS: XTAL_FC-135L,XTAL_FC-135M; FPLIST: XTAL_FC-135N,XTAL_FC-135L,XTAL_FC-135M; AutoDoc File: http://notefied-dynamic-precision.com/DB/Apps/Desktop/Item/Object.aspx?id=91966; Datasheet URL 2: http://www.eea.epson.com/portal/pls/portal/docs/1/1525451.PDF; Datasheet URL 1: http://www.eea.epson.com/portal/pls/portal/docs/1/1525528.PDF; MSL: N/A; MTBF Standard: N/A; MTBF: N/A; Esd Level: N/A; WEIGHT: N/A; Last Time Buy: N/A; RoHS Status: ROHS_COMPLIANT; Frequency: 32.768kHz; Min Oper Temp: -40DEGC; Max Oper Temp: +85DEGC; Part Type: CRYSTAL\OSCILLATOR\MEMS; Mounting Type: SMD; Old Footprint: XTAL_FC-135N; Revision: R001
Y2 = XTAL_4PIN_S: CRYSTAL, CRYSTAL OSCILLATOR, 24MHz, -15PPM/DEGC/+15PPM/DEGC, -40DEGC/+85DEGC, SMD; MPN Status: ACTIVE; MPN: TSX-3225 24.0000MF15X-AC3; Manufacturer: EPSON; Part Number: 12-00757; Packing Type: TAPE_&_REEL; Packing Size: 250; Budget Currency: EUR; Budget Price: 0.256; Lead Time: 12; NOTE Status: PREFERRED; Capacitance: 9pF; Min Tol: -10PPM; Max Tol: +10PPM; Old Footprint: OSCCC250X320X60-4N; ALT_SYMBOLS: OSCCC250X320X60-4L,OSCCC250X320X60-4M; FPLIST: OSCCC250X320X60-4N,OSCCC250X320X60-4L,OSCCC250X320X60-4M; AutoDoc File: http://notefied-dynamic-precision.com/DB/Apps/Desktop/Item/Object.aspx?id=96738; Datasheet URL 2: http://www.epsondevice.com/docs/qd/en/DownloadServlet?id=ID000658; Datasheet URL 1: http://www.eea.epson.com/portal/pls/portal/docs/1/1721495.PDF; RoHS Status: ROHS_COMPLIANT; Frequency: 24MHz; Min TC: -15PPM/DEGC; Max TC: +15PPM/DEGC; Min Oper Temp: -40DEGC; Max Oper Temp: +85DEGC; Part Type: CRYSTAL\OSCILLATOR; Mounting Type: SMD; Revision: R001